# Altium schematic sheet DS157-1.0-C心率传感器.SchDoc
size A4; SheetNumber: 1; SheetTotal: 1
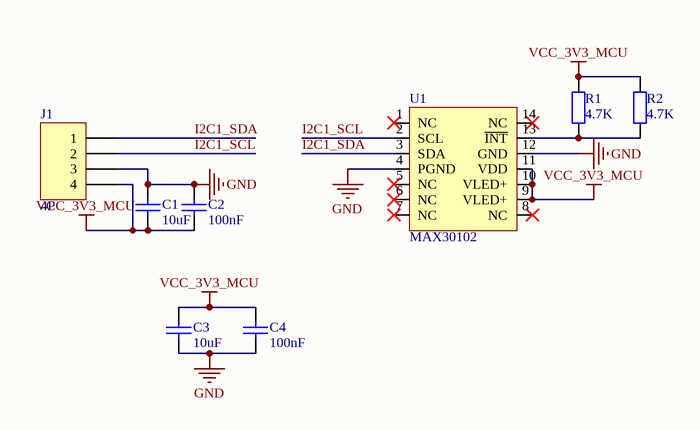
[diagram p0: DS157-1.0-C心率传感器.SchDoc]

## Parts
C1  value 10uF  [0603CAP]  (hidden comment: SMDCAP00016)
C2  value 100nF  [0603CAP]  (hidden comment: SMDCAP00013)
C3  value 10uF  [0603CAP]  (hidden comment: SMDCAP00016)
C4  value 100nF  [0603CAP]  (hidden comment: SMDCAP00013)
J1  value 4P  [SIP4]  (hidden comment: SL000000047)
R1  value 4.7K  [0603RES]  (hidden comment: SMDRES00047)
R2  value 4.7K  [0603RES]  (hidden comment: SMDRES00047)
U1  MAX30102  [OESIP-14]

## Nets
GND: C1.2 C2.2 C3.1 C4.1 J1.3 U1.4(PGND) U1.12(GND)
VCC_3V3_MCU: C1.1 C2.1 C3.2 C4.2 J1.4 R1.2 R2.2 U1.9(VLED+) U1.10(VLED+) U1.11(VDD)
I2C1_SCL: J1.2 U1.2(SCL)
I2C1_SDA: J1.1 U1.3(SDA)
NetR1_1: R1.1 R2.1 U1.13(~{INT})

Not connected (* = marked no-connect by the designer): U1 1(NC)* 5(NC)* 6(NC)* 7(NC)* 8(NC)* 14(NC)*

## Library data of the parts
C1 C3 = MLCC 10uF 50V ±10％ 0603: 贴片电容
C2 C4 = MLCC 100nF 50V ±10％ 0603: 贴片电容
J1 = DIP4 单排母座 间距2.54mm 铜: 单排母座
R1 R2 = Chip 4.7K 1/16W ±1％ 0603: 贴片电阻